# Altium schematic sheet LC_to_ADC.SchDoc
size A
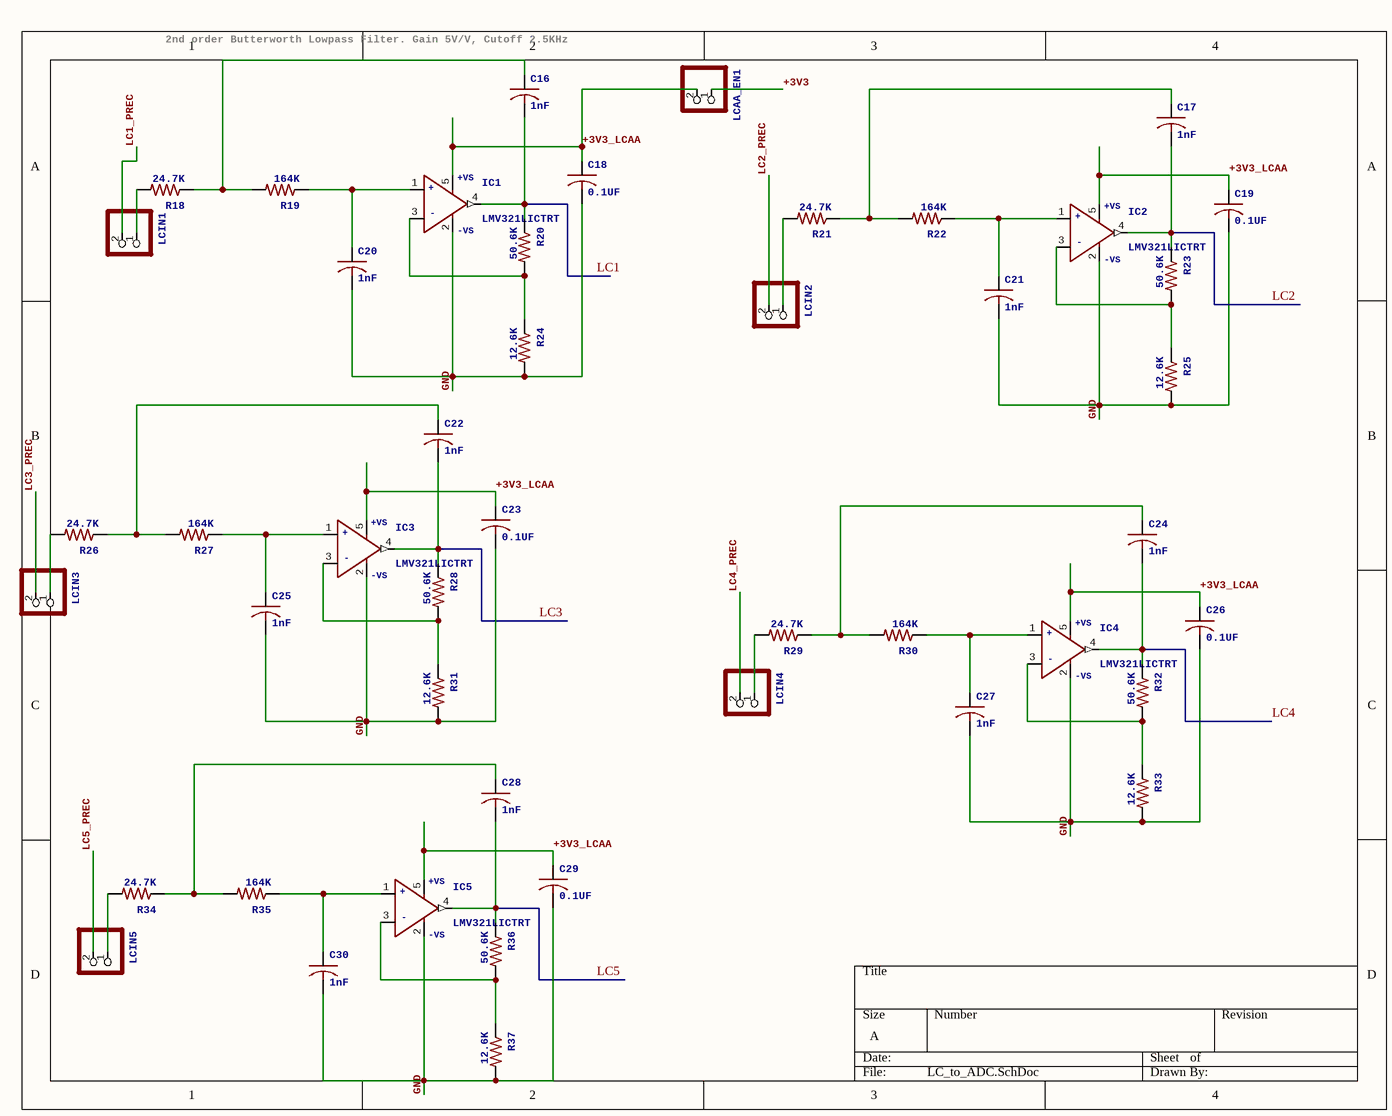
[diagram p0: LC_to_ADC.SchDoc]

## Parts
C16  1nF  [CAPCP2012X06N]
C17  1nF  [CAPCP2012X06N]
C18  0.1UF  [CAPCP2012X06N]
C19  0.1UF  [CAPCP2012X06N]
C20  1nF  [CAPCP2012X06N]
C21  1nF  [CAPCP2012X06N]
C22  1nF  [CAPCP2012X06N]
C23  0.1UF  [CAPCP2012X06N]
C24  1nF  [CAPCP2012X06N]
C25  1nF  [CAPCP2012X06N]
C26  0.1UF  [CAPCP2012X06N]
C27  1nF  [CAPCP2012X06N]
C28  1nF  [CAPCP2012X06N]
C29  0.1UF  [CAPCP2012X06N]
C30  1nF  [CAPCP2012X06N]
IC1  LMV321LICTRT  [SOT95P245X110-5N]
IC2  LMV321LICTRT  [SOT95P245X110-5N]
IC3  LMV321LICTRT  [SOT95P245X110-5N]
IC4  LMV321LICTRT  [SOT95P245X110-5N]
IC5  LMV321LICTRT  [SOT95P245X110-5N]
LCAA_EN1  PINHD-1X2  [MHDR1X2]  (value not drawn)
LCIN1  PINHD-1X2  [MHDR1X2]  (value not drawn)
LCIN2  PINHD-1X2  [MHDR1X2]  (value not drawn)
LCIN3  PINHD-1X2  [MHDR1X2]  (value not drawn)
LCIN4  PINHD-1X2  [MHDR1X2]  (value not drawn)
LCIN5  PINHD-1X2  [MHDR1X2]  (value not drawn)
R18  24.7K  [RESC_0805_2012]
R19  164K  [RESC_0805_2012]
R20  50.6K  [RESC_0805_2012]
R21  24.7K  [RESC_0805_2012]
R22  164K  [RESC_0805_2012]
R23  50.6K  [RESC_0805_2012]
R24  12.6K  [RESC_0805_2012]
R25  12.6K  [RESC_0805_2012]
R26  24.7K  [RESC_0805_2012]
R27  164K  [RESC_0805_2012]
R28  50.6K  [RESC_0805_2012]
R29  24.7K  [RESC_0805_2012]
R30  164K  [RESC_0805_2012]
R31  12.6K  [RESC_0805_2012]
R32  50.6K  [RESC_0805_2012]
R33  12.6K  [RESC_0805_2012]
R34  24.7K  [RESC_0805_2012]
R35  164K  [RESC_0805_2012]
R36  50.6K  [RESC_0805_2012]
R37  12.6K  [RESC_0805_2012]

## Nets
+3V3: LCAA_EN1.1
+3V3_LCAA: C18.1 C19.1 C23.1 C26.1 C29.1 IC1.5(+VS) IC2.5(+VS) IC3.5(+VS) IC4.5(+VS) IC5.5(+VS) LCAA_EN1.2
GND: C18.2 C19.2 C20.2 C21.2 C23.2 C25.2 C26.2 C27.2 C29.2 C30.2 IC1.2(-VS) IC2.2(-VS) IC3.2(-VS) IC4.2(-VS) IC5.2(-VS) R24.2 R25.2 R31.2 R33.2 R37.2
LC1: C16.2 IC1.4(OUT) R20.1
LC1_PREC: LCIN1.2
LC2: C17.2 IC2.4(OUT) R23.1
LC2_PREC: LCIN2.2
LC3: C22.2 IC3.4(OUT) R28.1
LC3_PREC: LCIN3.2
LC4: C24.2 IC4.4(OUT) R32.1
LC4_PREC: LCIN4.2
LC5: C28.2 IC5.4(OUT) R36.1
LC5_PREC: LCIN5.2
NetC16_1: C16.1 R18.1 R19.2
NetC17_1: C17.1 R21.1 R22.2
NetC20_1: C20.1 IC1.1(IN+) R19.1
NetC21_1: C21.1 IC2.1(IN+) R22.1
NetC22_1: C22.1 R26.1 R27.2
NetC24_1: C24.1 R29.1 R30.2
NetC25_1: C25.1 IC3.1(IN+) R27.1
NetC27_1: C27.1 IC4.1(IN+) R30.1
NetC28_1: C28.1 R34.1 R35.2
NetC30_1: C30.1 IC5.1(IN+) R35.1
NetIC1_3: IC1.3(IN-) R20.2 R24.1
NetIC2_3: IC2.3(IN-) R23.2 R25.1
NetIC3_3: IC3.3(IN-) R28.2 R31.1
NetIC4_3: IC4.3(IN-) R32.2 R33.1
NetIC5_3: IC5.3(IN-) R36.2 R37.1
NetLCIN1_1: LCIN1.1 R18.2
NetLCIN2_1: LCIN2.1 R21.2
NetLCIN3_1: LCIN3.1 R26.2
NetLCIN4_1: LCIN4.1 R29.2
NetLCIN5_1: LCIN5.1 R34.2

## Notes on the sheet
- 2nd order Butterworth Lowpass Filter. Gain 5V/V, Cutoff 2.5KHz

## Library data of the parts
C16-C30 = C-USC0805: CAPACITOR, American symbol; GateName_1: G$1; SymbolName_1: C-US; DeviceName: C0805; LibraryName: rcl; DeviceSetName: C-US; SPICEPREFIX: C
IC1-IC5 = LMV321LICTRT: High Performance, 145 MHz FastFET Op AmpsSource: http://www.analog.com/static/imported-files/data_sheets/AD8065_8066.pdf; MPN: AD8065ARTZ-REEL7; GateName_1: G$; SymbolName_1: OP+-VS; DeviceName: RT; MF: ALTERA CORPORATION; LibraryName: st-microelectronics-extra; DeviceSetName: LMV321LICT; OC_FARNELL: 1464845; OC_NEWARK: 59K6316; +: +; -: -; +VS: +VS; -VS: -VS
LCAA_EN1 LCIN1-LCIN5 = PINHD-1X2: PIN HEADER; GateName_1: G$1; SymbolName_1: PINHD2; LibraryName: pinhead; DeviceSetName: PINHD-1X2
R18-R37 = R-US_R0805: RESISTOR, American symbol; GateName_1: G$1; SymbolName_1: R-US; DeviceName: R0805; DeviceSetName: R-US_; LibraryName: rcl